# EAGLE design 5AC-DC (EAGLE 9.6.2)
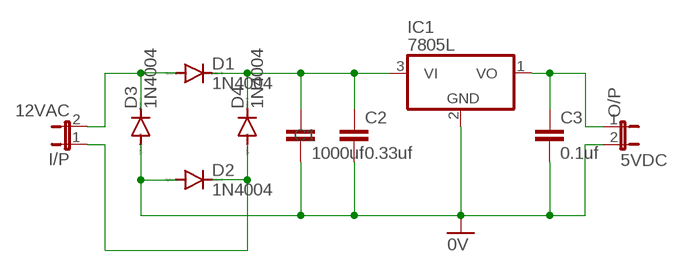
[diagram p0: schematic, sheet 1]

## Parts
C1  1000uf  C2,5-3  [C2.5-3]
C2  0.33uf  C2,5-3  [C2.5-3]
C3  0.1uf  C2,5-3  [C2.5-3]
D1  1N4004  [DO41-10]
D2  1N4004  [DO41-10]
D3  1N4004  [DO41-10]
D4  1N4004  [DO41-10]
I/P  12VAC  JP1E  [JP1]
IC1  7805L  [TO92]
O/P  5VDC  JP1E  [JP1]

## Nets
0V: C1.2 C2.2 C3.2 D2.A D3.A IC1.2(GND) O/P.2
N$1: D1.A D3.C I/P.2
N$2: C1.1 C2.1 D1.C D4.C IC1.3(VI)
N$4: D2.C D4.A I/P.1
N$6: C3.1 IC1.1(VO) O/P.1

## Library data of the parts
C1-C3 = capacitor-wima:C: CAPACITOR naming: grid - package width
D1-D4 = diode:1N4004: DIODE general purpose rectifier, 1 A
I/P O/P = jumper:JP1E: JUMPER
IC1 = linear:78*: Positive VOLTAGE REGULATOR Source: http://cache.national.com/ds/LM/LM78L05.pdf http://www.fairchildsemi.com/ds/LM/LM7805.pdf

## Board
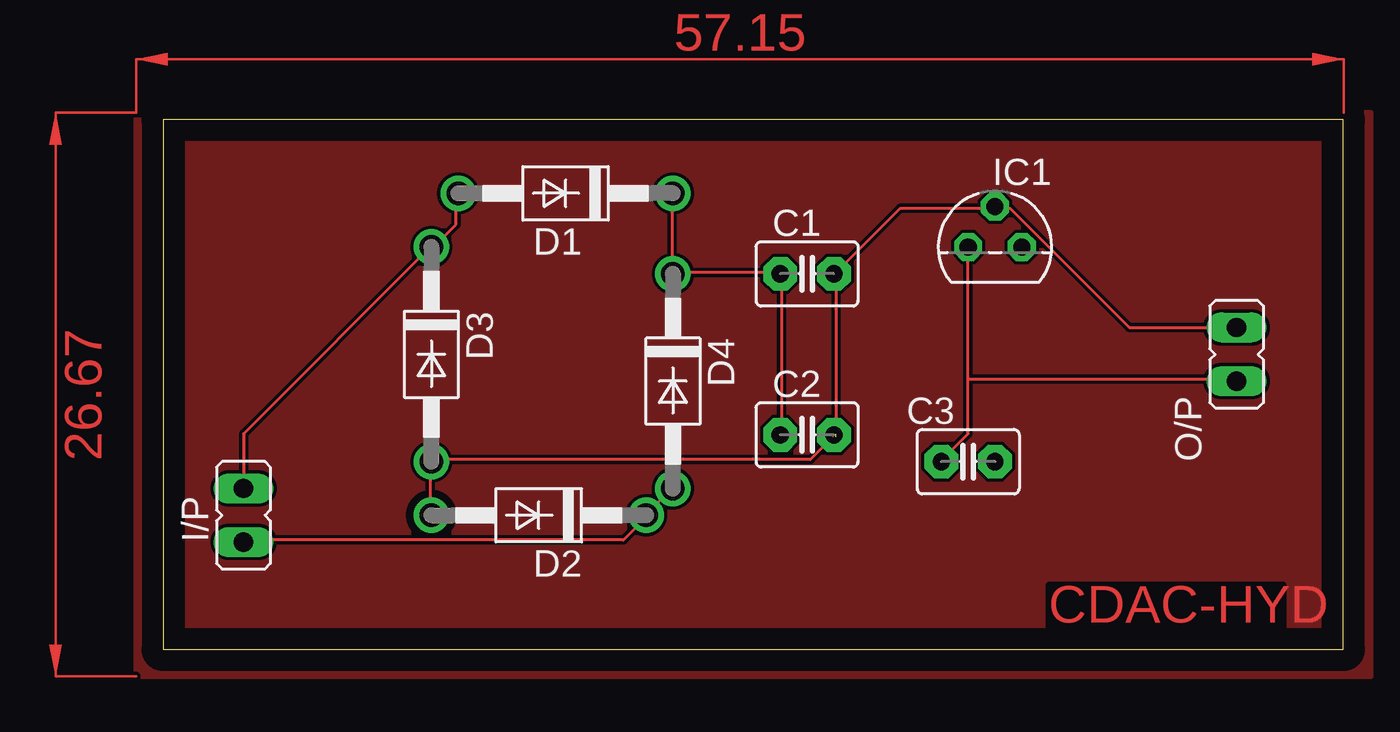
[diagram p1: board, top side]
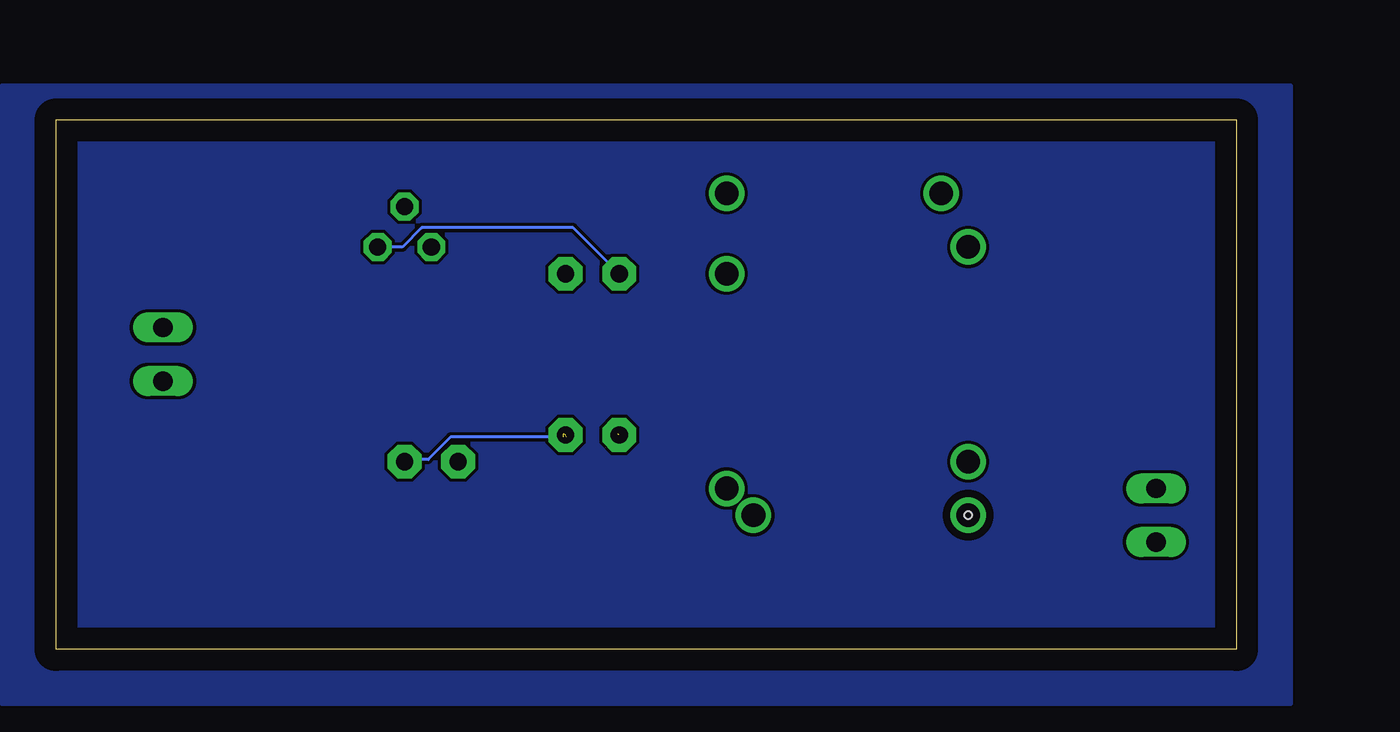
[diagram p2: board, bottom side, seen from below]

Size 55.86 x 25.07 mm. Coordinates in mm from the lower left corner, seen from the top.
Outline: 0,0 55.86,0 55.86,25.07 0,25.07 0,0
Copper layers (1*16): Top 0.035mm / dielectric 1.5mm / Bottom 0.035mm
Design rules "default": minimum track width 6mil, minimum drill 0.35mm, track to track 6mil, track to pad 6mil, pad to pad 6mil, via to via 6mil, smd to smd 6mil, copper to edge 40mil, drill to drill 6mil, minimum pad ring 10mil, minimum via ring 8mil, stop-mask expansion 4mil, vias tented up to drill 0mil, thermal gap 10mil
Holes 0.35 mm at 12.7,6.35

### Footprints (pad centres in the part's own frame; a part is rotated, then mirrored left to right if it is on the bottom)
C2.5-3 = drill 0.813 pad 1.6 octagon: 1 -1.27,0; 2 1.27,0
DO41-10 = drill 1.118: A 5.08,0; C -5.08,0
JP1 = drill 0.914 long: 1 0,-1.27; 2 0,1.27
TO92 = drill 0.813 octagon: 1 -1.27,0; 2 0,1.905; 3 1.27,0

### Placement (x,y rotation side)
C1  30.48,17.78 0 top
C2  30.48,10.16 0 top
C3  38.1,8.89 0 top
D1  19.05,21.59 180 top
D2  17.78,6.35 180 top
D3  12.7,13.97 270 top
D4  24.13,12.7 270 top
I/P  3.81,6.35 0 top
IC1  39.37,19.05 0 top
O/P  50.8,13.97 0 top

### Tracks (layer width: path | path; a pad name or v marks a point on that pad's centre or on a via)
0V  (3 unrouted)
  Top 0.152: D2.A 12.65,6.4 12.65,8.84 D3.A 12.8,8.99 30.63,8.99 31.7,10.06 | O/P.2 45.72,15.24 40.08,20.88 39.47,20.88 IC1.2 39.32,20.88 34.9,20.88 31.85,17.83 C1.2 31.85,17.68 31.85,10.21
  Bottom 0.152: 31.85,10.06 37.19,10.06 38.25,8.99 39.32,8.99 C3.2
GND
  pour Top: -1.27,25.4 57.15,25.4 57.15,-1.27 -1.27,-1.27
  pour Bottom: -2.54,26.67 58.42,26.67 58.42,-2.54 -2.54,-2.54 -2.54,-1.27
N$1
  Top 0.152: I/P.2 3.81,10.21 12.65,19.05 D3.C 12.8,19.05 13.87,20.12 13.87,21.49 D1.A
N$2  (1 unrouted)
  Top 0.152: D1.C 24.08,21.49 24.08,17.83 D4.C 24.23,17.83 29.11,17.83 C1.1 29.26,17.68 29.26,10.21
  Bottom 0.152: IC1.3 39.47,19.05 38.56,19.96 31.39,19.96 C1.1
N$4
  Top 0.152: I/P.1 3.81,5.18 21.79,5.18 22.86,6.25 D2.C 22.86,6.4 24.08,7.62 D4.A
N$6
  Top 0.152: 38.1,12.8 38.1,10.21 36.88,8.99 C3.1 | 38.1,12.8 IC1.1 | 38.1,12.8 50.75,12.8 O/P.1
(copper drawn outside any net)
  shapes: Top area x2

### Text on the board
Top: CDAC-HYD